# EAGLE design shield board (EAGLE 9.5.1)
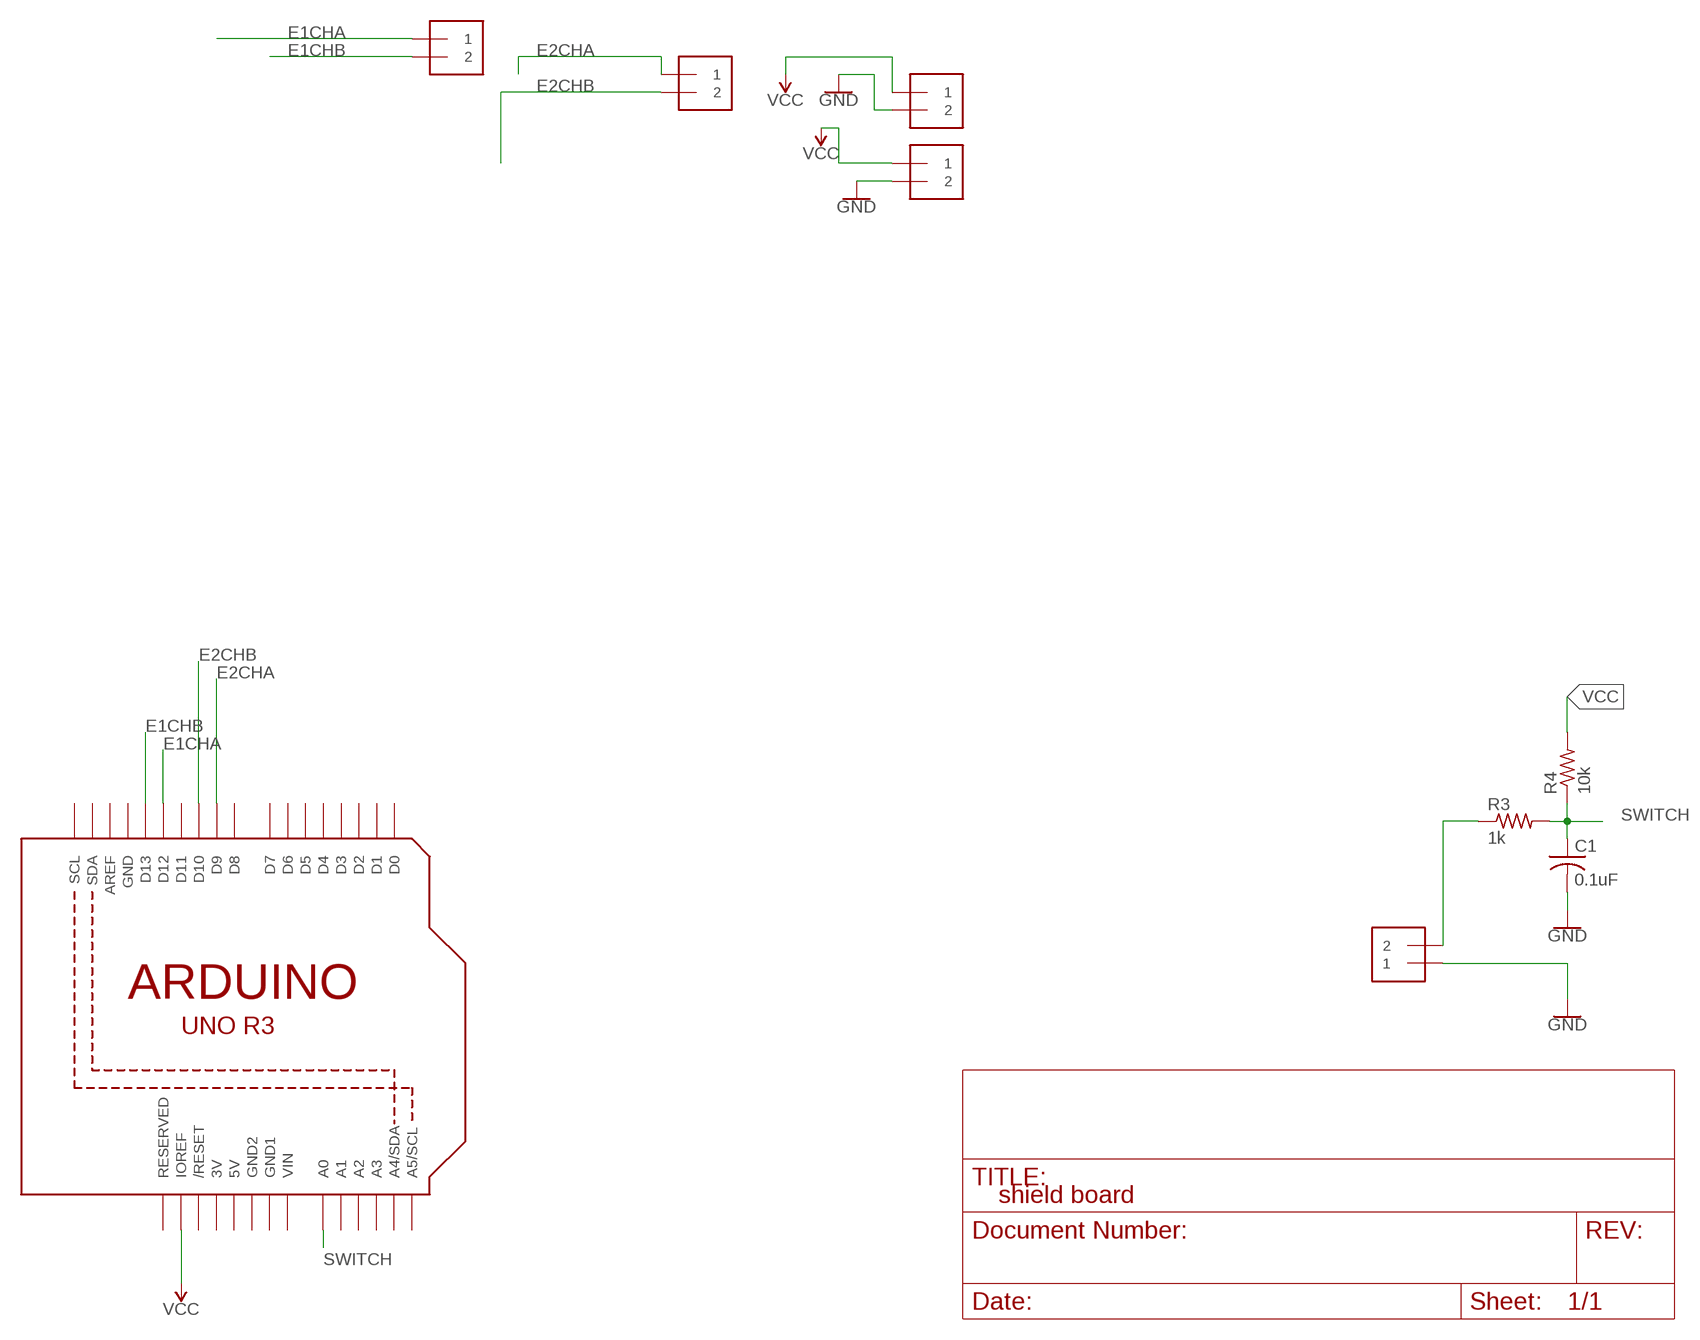
[diagram p0: schematic, sheet 1]

## Parts
C1  0.1uF  C-USC0603  [C0603]
R3  1k  R-US_R0603  [R0603]
R4  10k  R-US_R0603  [R0603]
U1  ARDUINOR3-BPLACE  [ARDUINOR3-BPLACE]
U$2  MOLEX_0039301022  [MINI-FIT_JR_CONN]
U$3  MOLEX_0039301022  [MINI-FIT_JR_CONN]
U$4  MOLEX_0039301022  [MINI-FIT_JR_CONN]
U$5  MOLEX_0039301022  [MINI-FIT_JR_CONN]
U$6  MOLEX_0039301022  [MINI-FIT_JR_CONN]

## Nets
E1CHA: U1.D12 U$5.P$2
E1CHB: U1.D13 U$5.P$1
E2CHA: U1.D9 U$6.P$2
E2CHB: U1.D10 U$6.P$1
GND: C1.2 U$2.P$2 U$3.P$1 U$4.P$1
N$4: R3.1 U$2.P$1
SWITCH: C1.1 R3.2 R4.1 U1.A0
VCC: R4.2 U1.IOREF U$3.P$2 U$4.P$2
Unconnected: U1.A1 U1.A2 U1.A3 U1.A4(A4/SDA) U1.A5(A5/SCL) U1.AREF U1.D0 U1.D1 U1.D2 U1.D3 U1.D4 U1.D5 U1.D6 U1.D7 U1.D8 U1.D11 U1.RESERVED U1.RESET(/RESET) U1.SCL U1.SDA

## Power pins joined to a net without a drawn wire
3V: U1.3V
GND: U1.GND
GND1: U1.GND1
GND2: U1.GND2
VCC: U1.5V
VIN: U1.VIN

## Library data of the parts
C1 = adafruit:C-US: CAPACITOR, American symbol
R3 R4 = resistor:R-US_: RESISTOR, American symbol
U1 = adafruit:ARDUINOR3: This is a new object for the new Arduino R3 - with extra pins that you may want to use (such as IOref, and duplicated A4/A5
U$2-U$6 = pat:MOLEX_0039301022

## Board
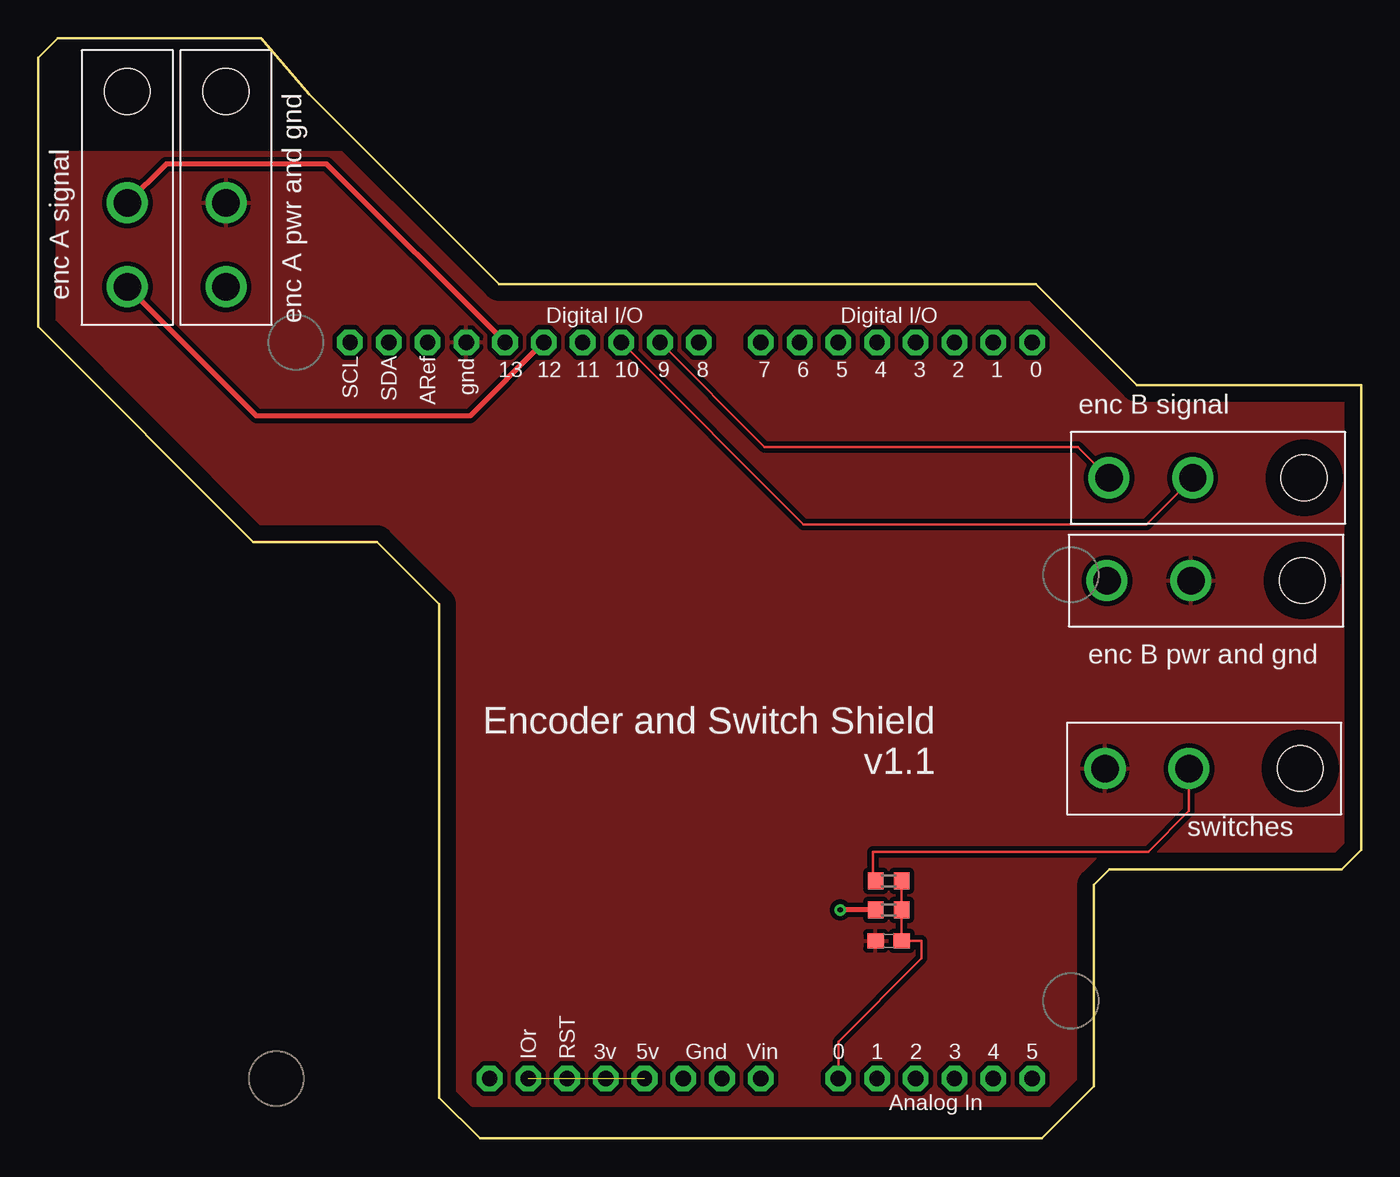
[diagram p1: board, top side]
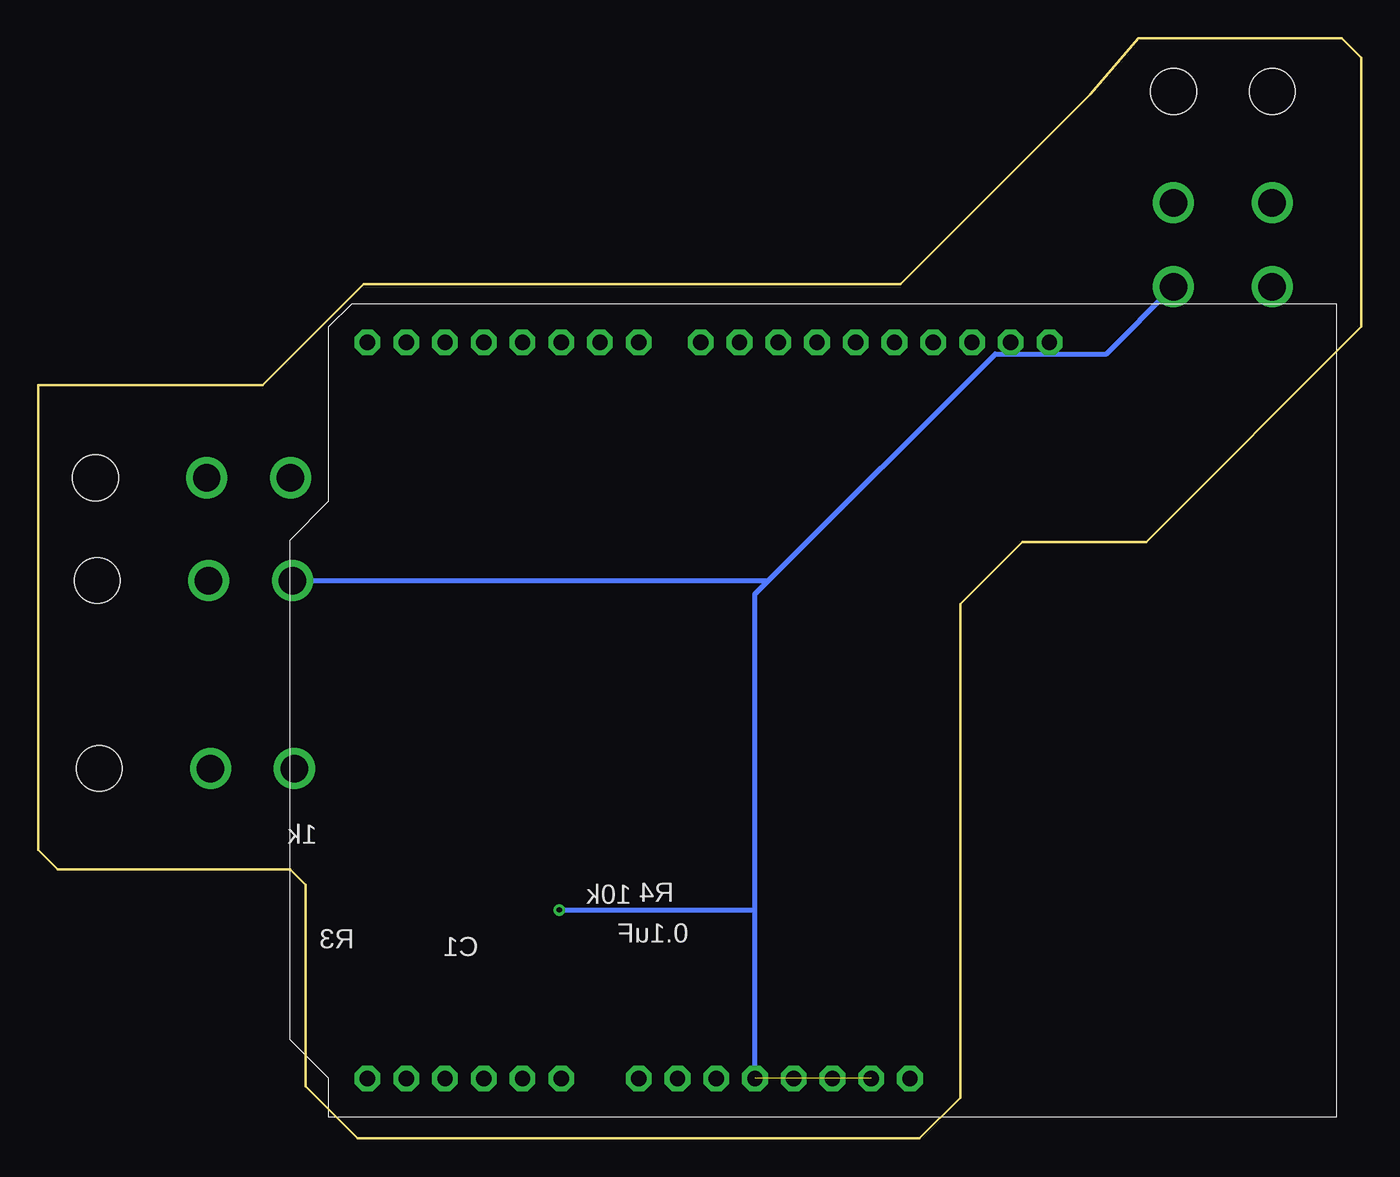
[diagram p2: board, bottom side, seen from below]

Size 86.74 x 72.14 mm. Coordinates in mm from the lower left corner, seen from the top.
Outline: 0,70.87 0,53.21 14.1,39.12 22.23,39.12 26.29,35.05 26.29,2.67 28.96,0 65.79,0 69.22,3.43 69.22,16.64 70.23,17.65 85.47,17.65 86.74,18.92 86.74,49.4 72.01,49.4 65.41,56.01 30.23,56.01 17.78,68.45 14.61,72.14 1.27,72.14 0,70.87
Copper layers (1*16): Top 0.035mm / dielectric 1.5mm / Bottom 0.035mm
Design rules "default *": minimum track width 6mil, minimum drill 0.35mm, track to track 6mil, track to pad 6mil, pad to pad 6mil, via to via 6mil, smd to smd 6mil, copper to edge 40mil, drill to drill 10mil, minimum pad ring 10mil, minimum via ring 8mil, stop-mask expansion 4mil, vias tented up to drill 0mil, thermal gap 10mil

### Footprints (pad centres in the part's own frame; a part is rotated, then mirrored left to right if it is on the bottom)
C0603 = smd 1.1 x 1: 1 -0.85,0; 2 0.85,0
R0603 = smd 1 x 1.1: 1 -0.85,0; 2 0.85,0
ARDUINOR3-BPLACE = drill 1 pad 1.676 octagon: 3V 35.56,2.54; 5V 38.1,2.54; A0 50.8,2.54; A1 53.34,2.54; A2 55.88,2.54; A3 58.42,2.54; A4 60.96,2.54; A5 63.5,2.54; AREF 23.876,50.8; D0 63.5,50.8; D1 60.96,50.8; D2 58.42,50.8; D3 55.88,50.8; D4 53.34,50.8; D5 50.8,50.8; D6 48.26,50.8; D7 45.72,50.8; D8 41.656,50.8; D9 39.116,50.8; D10 36.576,50.8; D11 34.036,50.8; D12 31.496,50.8; D13 28.956,50.8; GND 26.416,50.8; GND1 43.18,2.54; GND2 40.64,2.54; IOREF 30.48,2.54; RESERVED 27.94,2.54; RESET 33.02,2.54; SCL 18.796,50.8; SDA 21.336,50.8; VIN 45.72,2.54
MINI-FIT_JR_CONN = drill 1.8: P$1 0,0; P$2 0,5.5 | hole 3: 0,-7.3

### Placement (x,y rotation side)
C1  55.75,12.95 180 top
R3  55.75,16.89 0 top
R4  55.75,14.99 180 top
U1  1.65,1.4 0 top
U$2  75.44,24.26 90 top
U$3  75.56,36.58 90 top
U$4  12.32,61.34 180 top
U$5  5.84,61.34 180 top
U$6  75.69,43.31 90 top

### Tracks (layer width: path | path; a pad name or v marks a point on that pad's centre or on a via)
E1CHA
  Top 0.152: 33.15,51.82 U1.D12
  Top 0.33: U$5.P$2 14.31,47.37 28.32,47.37 U1.D12
E1CHB
  Top 0.33: U$5.P$1 8.38,63.88 18.92,63.88 U1.D13
E2CHA
  Top 0.152: U$6.P$2 68.16,45.34 47.63,45.34 U1.D9
E2CHB
  Top 0.152: U$6.P$1 72.64,40.26 50.16,40.26 U1.D10
GND
  pour Top (isolate 0.305): 0.64,64.64 0.64,2.16 87.5,2.16 87.5,64.64
N$4
  Top 0.152: U$2.P$1 75.44,21.46 72.77,18.8 54.74,18.8 54.74,17.06 R3.1
SWITCH
  Top 0.152: U1.A0 52.45,6.35 57.91,11.81 57.91,12.95 56.64,12.95 | 56.64,12.95 C1.1 | R3.2 R4.1 56.6,12.99 56.64,12.95
VCC  (via drill 0.35)  (1 unrouted)
  Top 0.33: R4.2 v52.58,14.99
  Bottom 0.33: U$4.P$2 16.73,51.44 24,51.44 38.86,36.58 | U$3.P$2 38.86,36.58 | U1.5V 39.75,14.99 | 39.75,14.99 39.75,35.69 38.86,36.58 | v52.58,14.99 39.75,14.99

### Text on the board
tPlace: enc A signal | enc A pwr and gnd | enc B signal | enc B pwr and gnd | Encoder and Switch Shield / v1.1 | switches